# Altium schematic sheet 接收端原理图.SchDoc
size A3; SheetNumber: 1; SheetTotal: 1
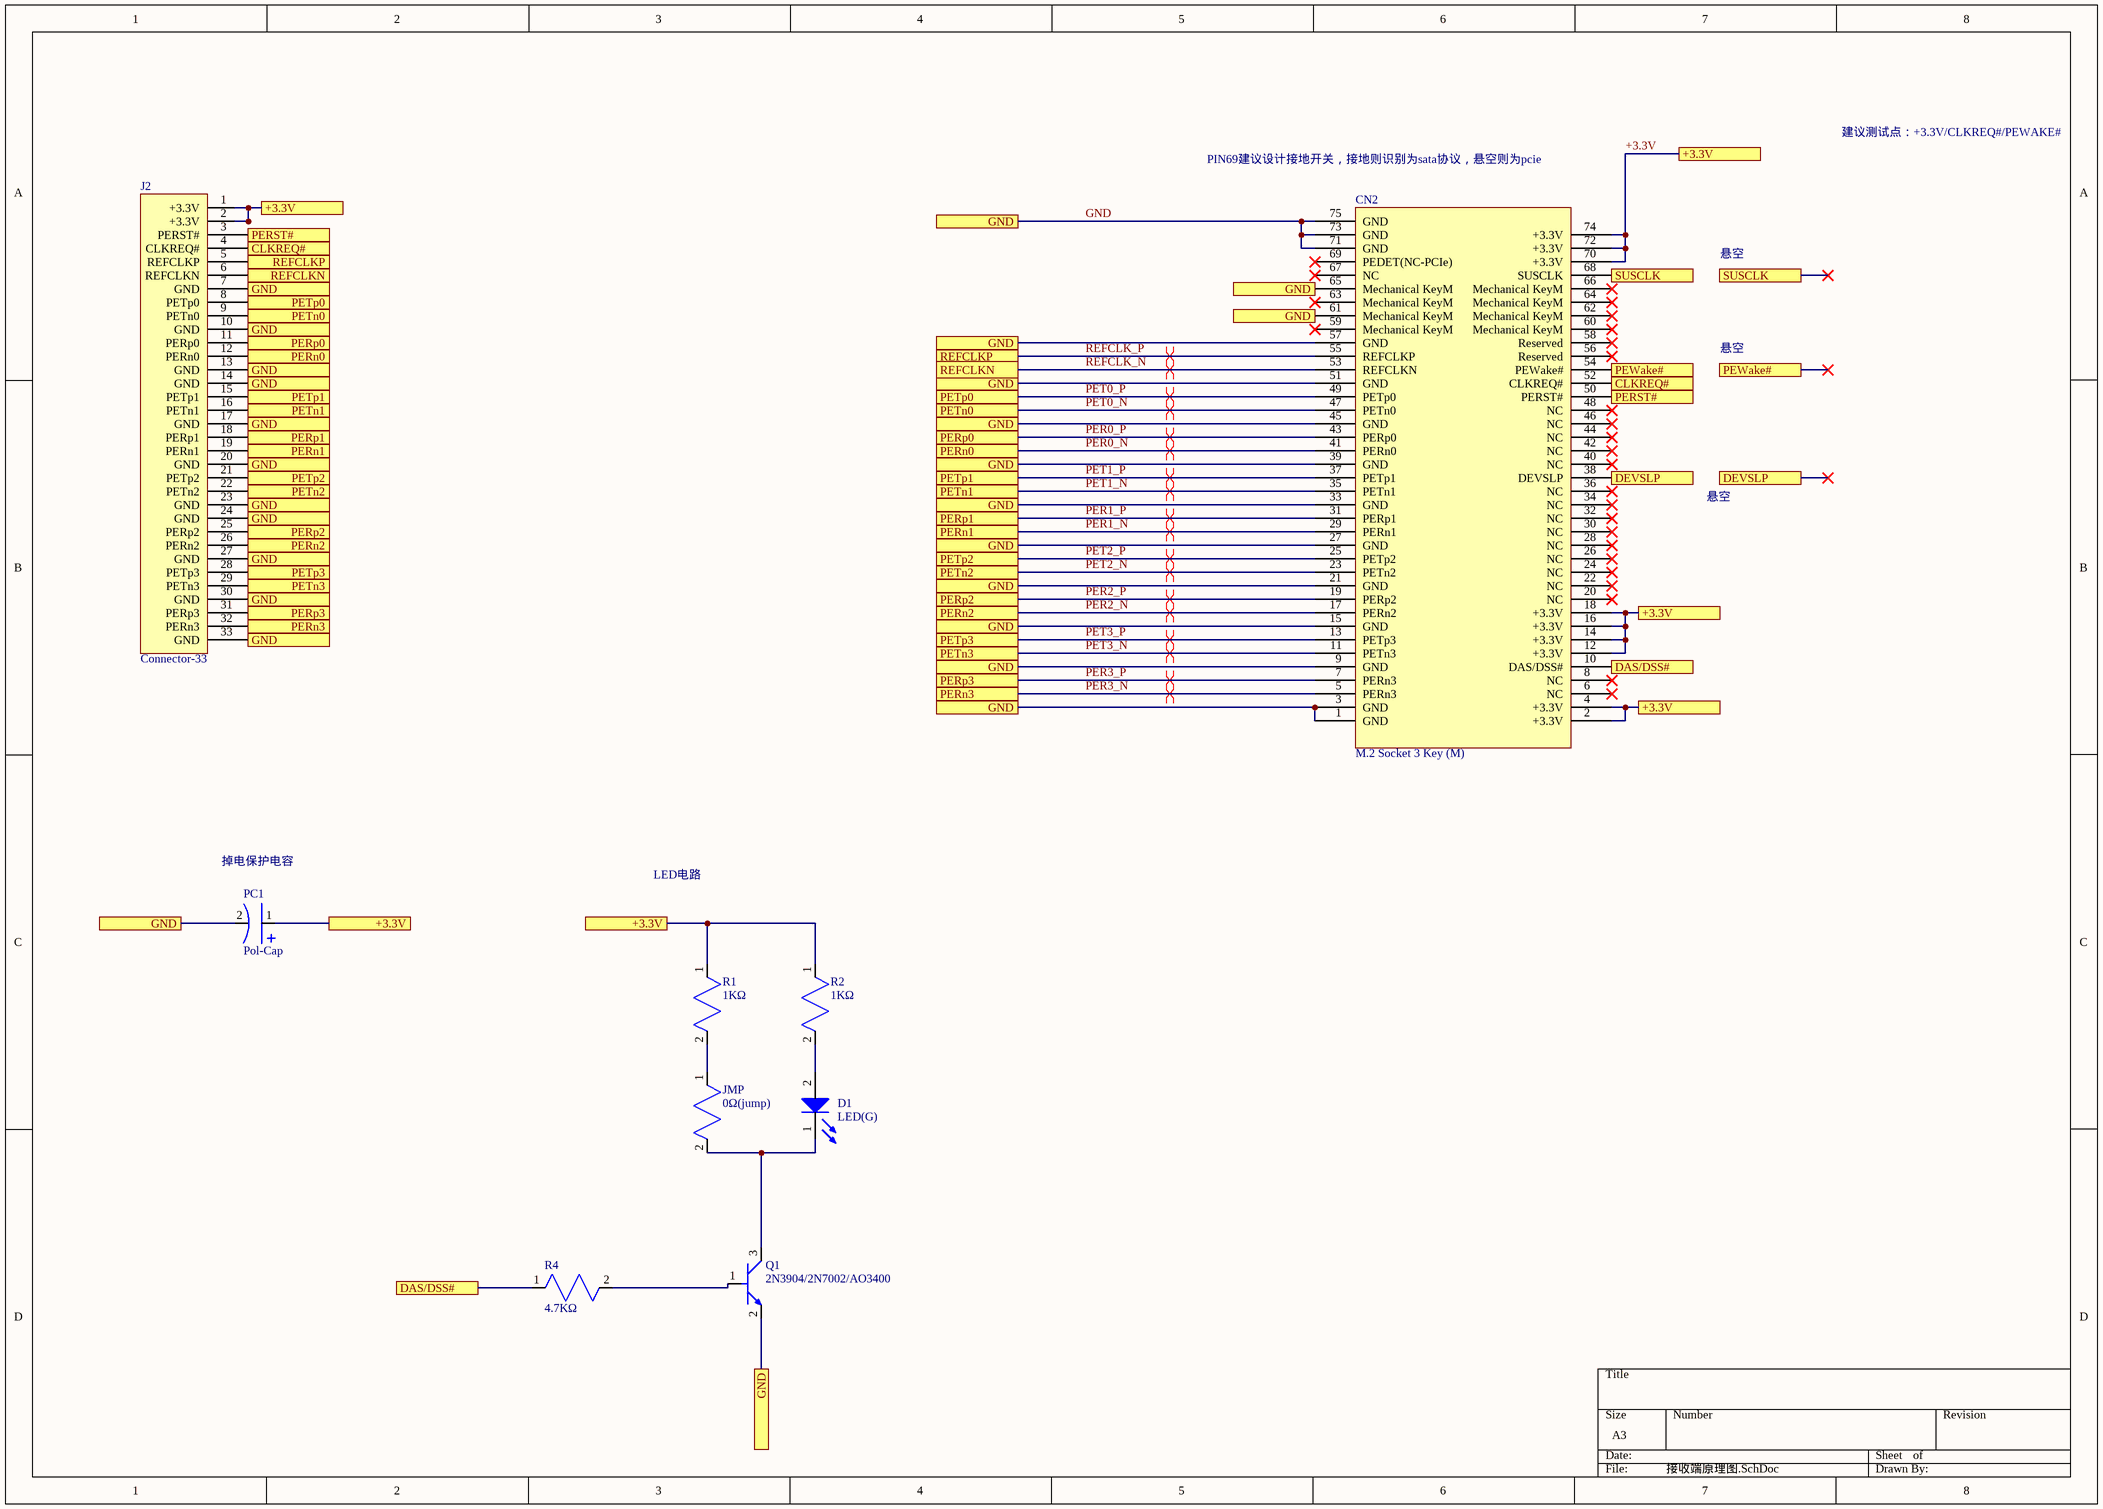
[diagram p0: 接收端原理图.SchDoc]

## Parts
CN2  M.2 Socket 3 Key (M)  [m.2 2.3H]
D1  LED(G)  [0603C]
J2  Connector-33  [b2b-hole]
JMP  0Ω(jump)  [0603C]
PC1  Pol-Cap  [7343T]
Q1  2N3904/2N7002/AO3400  [SOT23-3]
R1  1KΩ  [0603C]
R2  1KΩ  [0603C]
R4  4.7KΩ  [0603C]

## Ports
+3.3V, CLKREQ#, DAS/DSS#, DEVSLP, GND, PERn0, PERn1, PERn2, PERn3, PERp0, PERp1, PERp2, PERp3, PERST#, PETn0, PETn1, PETn2, PETn3, PETp0, PETp1, PETp2, PETp3, PEWake#, REFCLKN, REFCLKP, SUSCLK

## Nets
+3.3V: CN2.2(+3.3V) CN2.4(+3.3V) CN2.12(+3.3V) CN2.14(+3.3V) CN2.16(+3.3V) CN2.18(+3.3V) CN2.70(+3.3V) CN2.72(+3.3V) CN2.74(+3.3V) J2.1(+3.3V) J2.2(+3.3V) PC1.1 R1.1 R2.1 ; port +3.3V
CLKREQ#: CN2.52(CLKREQ#) J2.4(CLKREQ#) ; port CLKREQ#
DAS/DSS#: CN2.10(DAS/DSS#) R4.1 ; port DAS/DSS#
DEVSLP: CN2.38(DEVSLP) ; port DEVSLP
GND: CN2.1(GND) CN2.3(GND) CN2.9(GND) CN2.15(GND) CN2.21(GND) CN2.27(GND) CN2.33(GND) CN2.39(GND) CN2.45(GND) CN2.51(GND) CN2.57(GND) CN2.61(Mechanical_KeyM) CN2.65(Mechanical_KeyM) CN2.71(GND) CN2.73(GND) CN2.75(GND) J2.7(GND) J2.10(GND) J2.13(GND) J2.14(GND) J2.17(GND) J2.20(GND) J2.23(GND) J2.24(GND) J2.27(GND) J2.30(GND) J2.33(GND) PC1.2 Q1.2 ; port GND
PER0_N: CN2.41(PERn0) J2.12(PERn0) ; port PERn0
PER0_P: CN2.43(PERp0) J2.11(PERp0) ; port PERp0
PER1_N: CN2.29(PERn1) J2.19(PERn1) ; port PERn1
PER1_P: CN2.31(PERp1) J2.18(PERp1) ; port PERp1
PER2_N: CN2.17(PERn2) J2.26(PERn2) ; port PERn2
PER2_P: CN2.19(PERp2) J2.25(PERp2) ; port PERp2
PER3_N: CN2.5(PERn3) J2.32(PERn3) ; port PERn3
PER3_P: CN2.7(PERn3) J2.31(PERp3) ; port PERp3
PERST#: CN2.50(PERST#) J2.3(PERST#) ; port PERST#
PET0_N: CN2.47(PETn0) J2.9(PETn0) ; port PETn0
PET0_P: CN2.49(PETp0) J2.8(PETp0) ; port PETp0
PET1_N: CN2.35(PETn1) J2.16(PETn1) ; port PETn1
PET1_P: CN2.37(PETp1) J2.15(PETp1) ; port PETp1
PET2_N: CN2.23(PETn2) J2.22(PETn2) ; port PETn2
PET2_P: CN2.25(PETp2) J2.21(PETp2) ; port PETp2
PET3_N: CN2.11(PETn3) J2.29(PETn3) ; port PETn3
PET3_P: CN2.13(PETp3) J2.28(PETp3) ; port PETp3
PEWake#: CN2.54(PEWake#) ; port PEWake#
REFCLK_N: CN2.53(REFCLKN) J2.6(REFCLKN) ; port REFCLKN
REFCLK_P: CN2.55(REFCLKP) J2.5(REFCLKP) ; port REFCLKP
SUSCLK: CN2.68(SUSCLK) ; port SUSCLK
NetD1_1: D1.1 JMP.2 Q1.3
NetD1_2: D1.2 R2.2
NetJMP_1: JMP.1 R1.2
NetQ1_1: Q1.1 R4.2

Not connected (* = marked no-connect by the designer): CN2 6(NC)* 8(NC)* 20(NC)* 22(NC)* 24(NC)* 26(NC)* 28(NC)* 30(NC)* 32(NC)* 34(NC)* 36(NC)* 40(NC)* 42(NC)* 44(NC)* 46(NC)* 48(NC)* 56(Reserved)* 58(Reserved)* 59(Mechanical_KeyM)* 60(Mechanical_KeyM)* 62(Mechanical_KeyM)* 63(Mechanical_KeyM)* 64(Mechanical_KeyM)* 66(Mechanical_KeyM)* 67(NC)* 69(PEDET(NC-PCIe))*

## Layout directives
differential pair: PER0_N, PER0_P, PER1_N, PER1_P, PER2_N, PER2_P, PER3_N, PER3_P, PET0_N, PET0_P, PET1_N, PET1_P, PET2_N, PET2_P, PET3_N, PET3_P, REFCLK_N, REFCLK_P

## Notes on the sheet
- PIN69建议设计接地开关，接地则识别为sata协议，悬空则为pcie
- 建议测试点：+3.3V/CLKREQ#/PEWAKE#
- 悬空
- 掉电保护电容
- LED电路

## Library data of the parts
D1 = LED
JMP R1 R2 R4 = Resistor